# Altium schematic sheet LEDs.SchDoc
size D
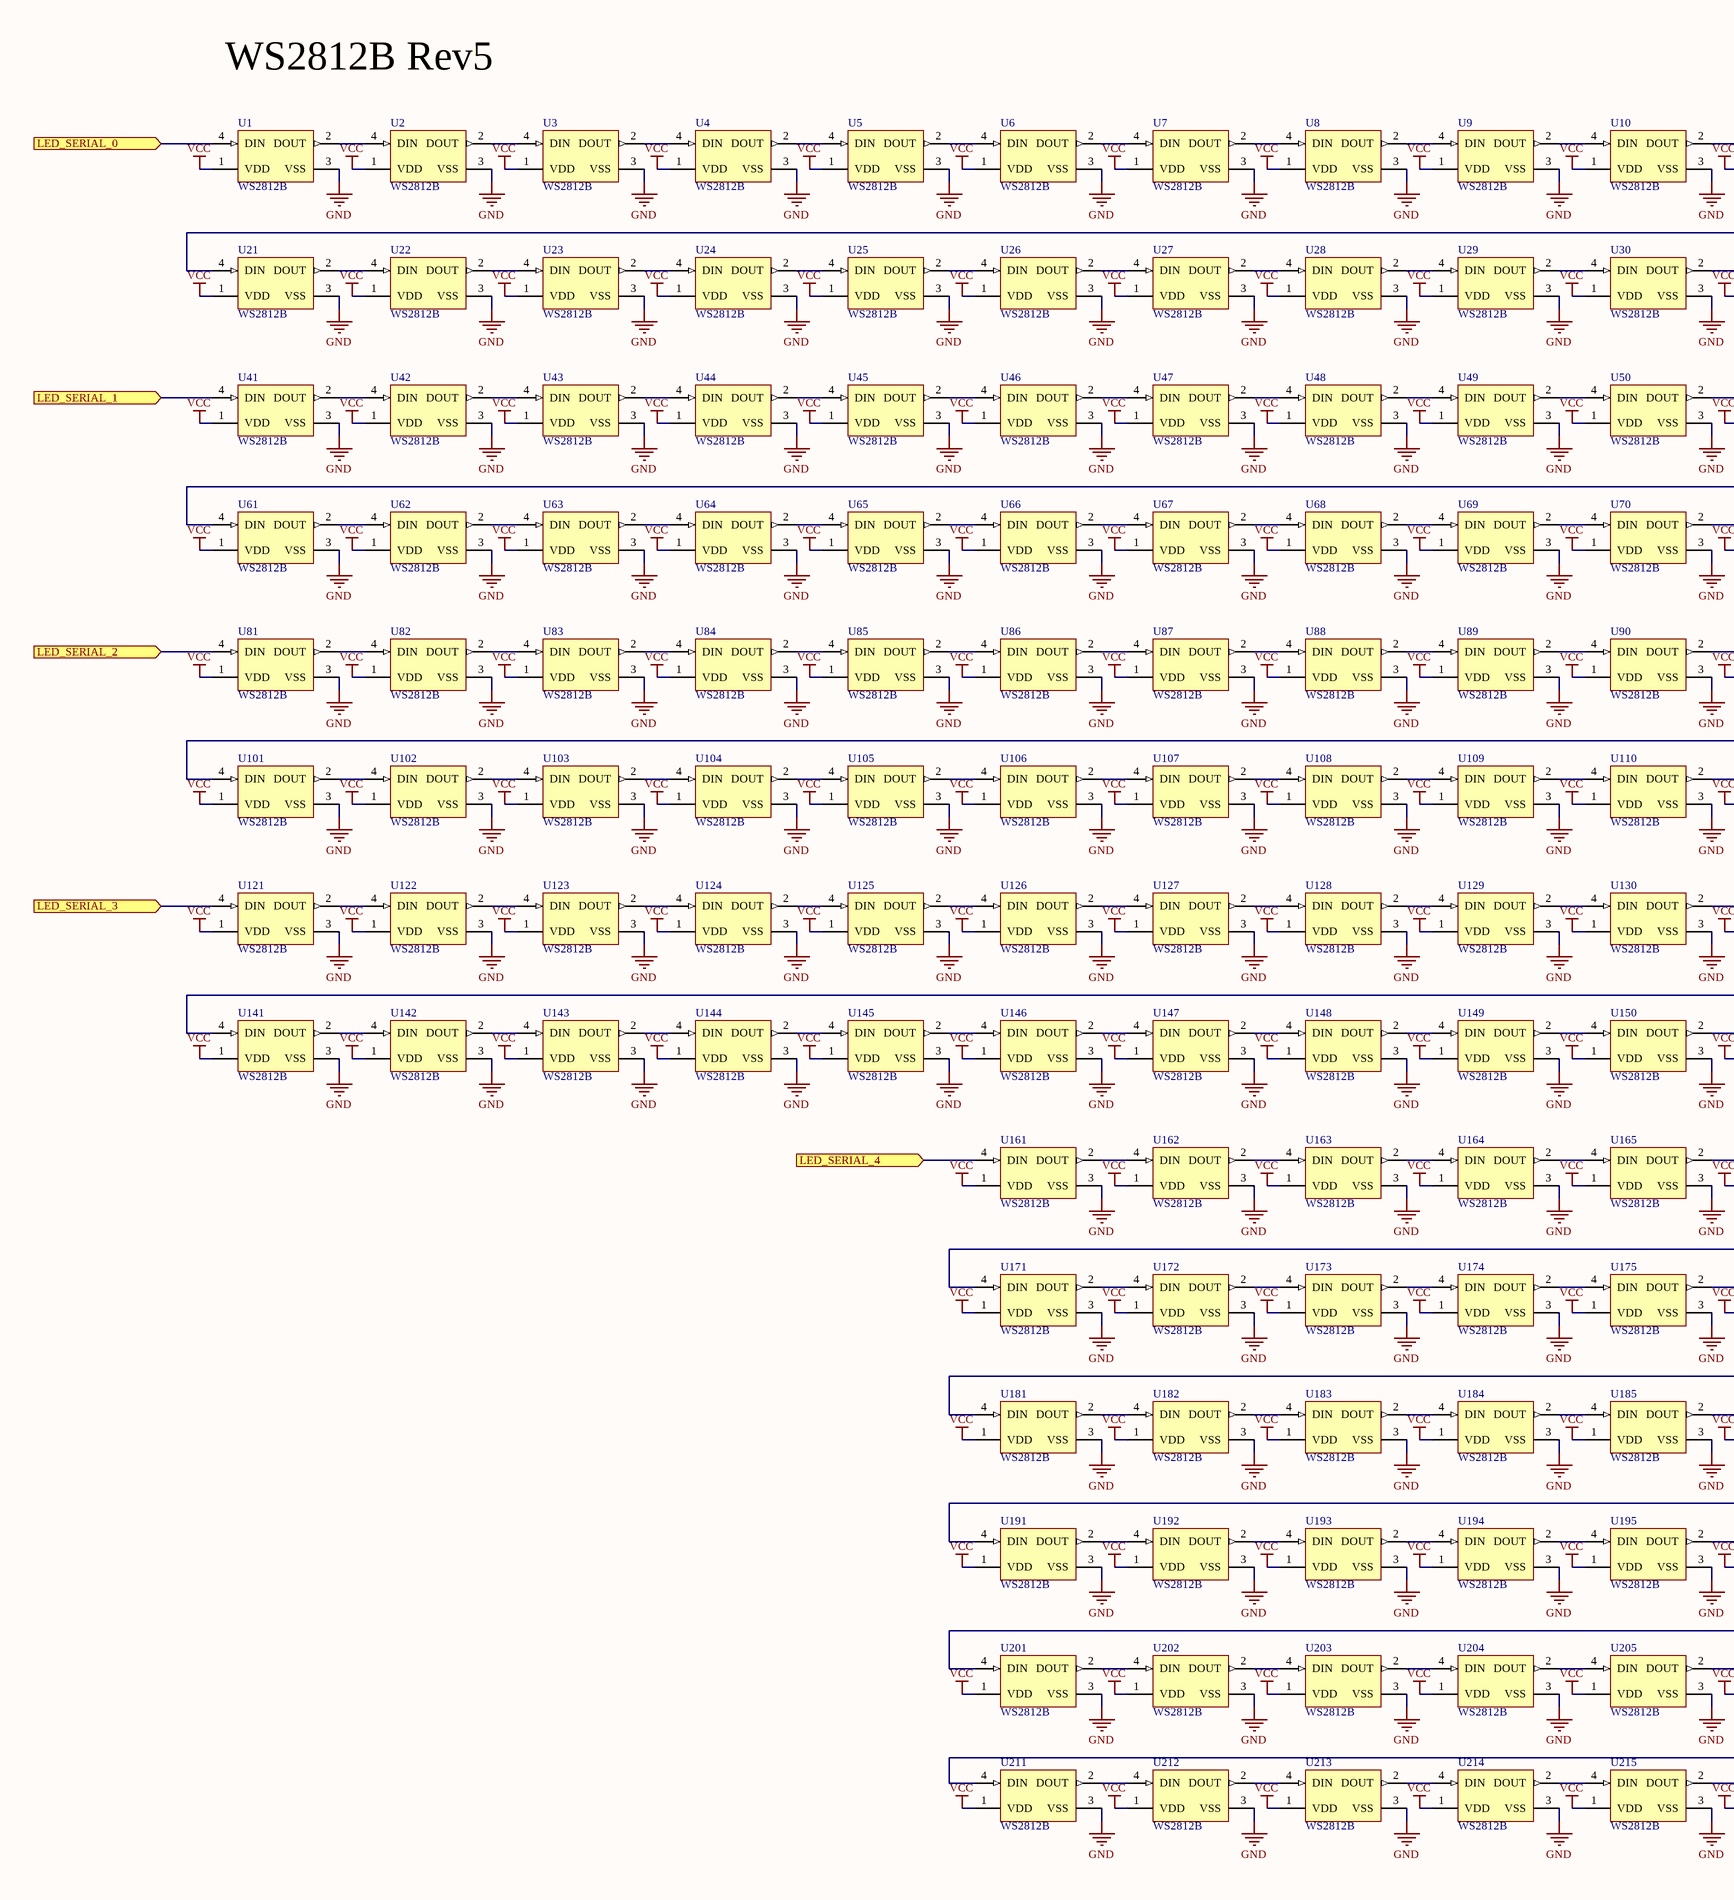
[diagram p0: LEDs.SchDoc, left]
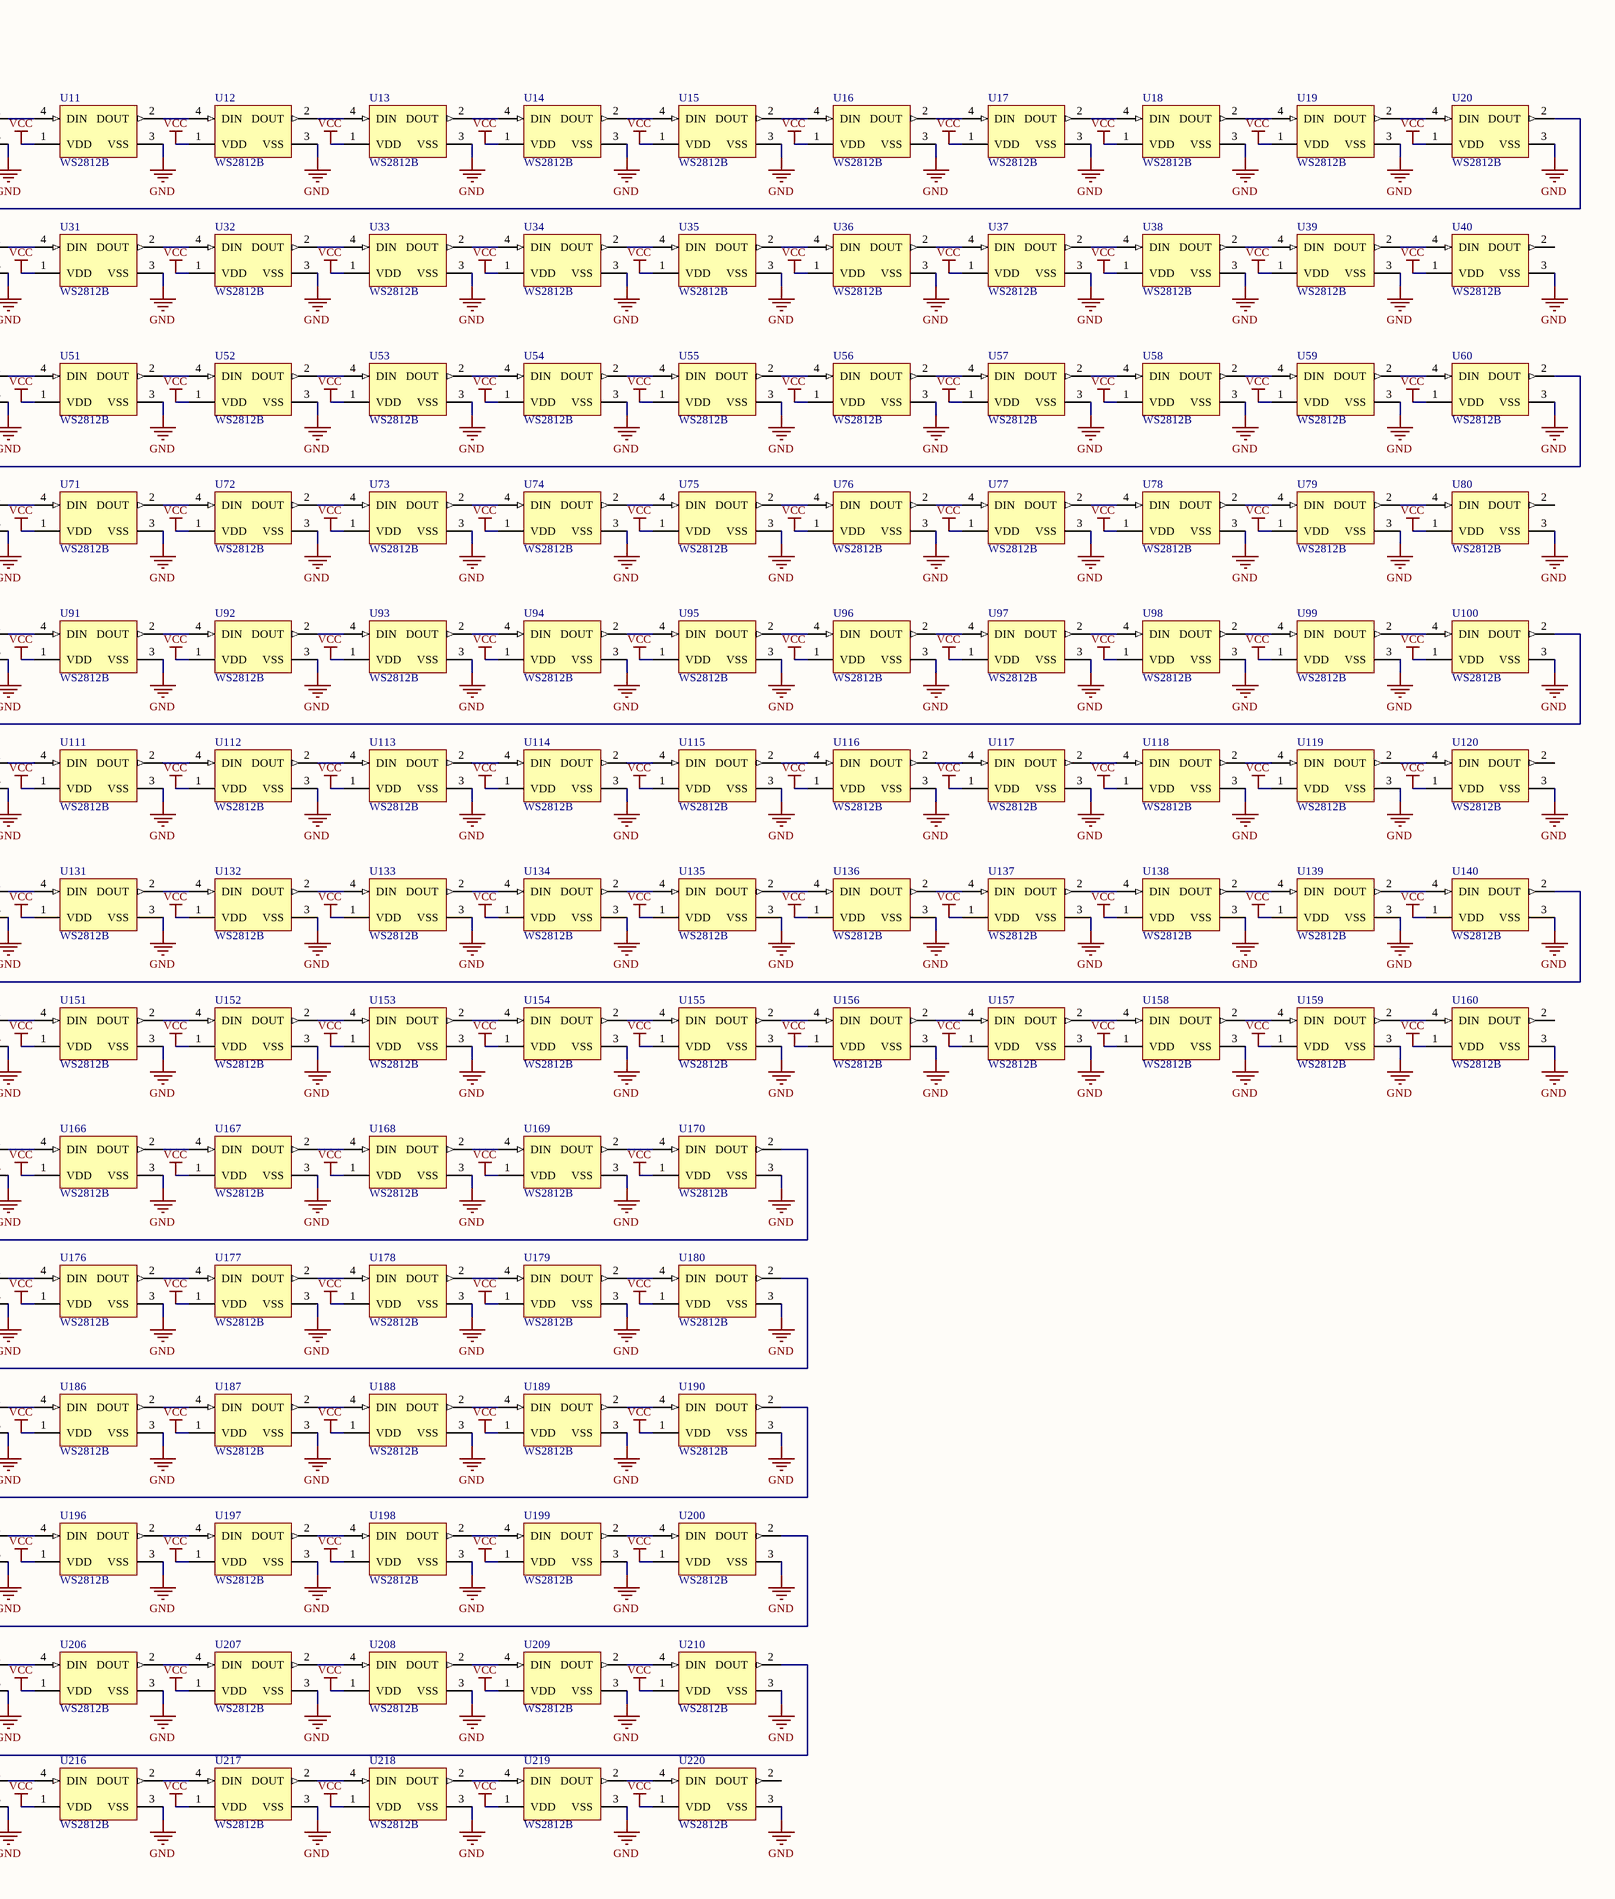
[diagram p1: LEDs.SchDoc, right]

## Parts
U1  WS2812B  [LED5050]
U2  WS2812B  [LED5050]
U3  WS2812B  [LED5050]
U4  WS2812B  [LED5050]
U5  WS2812B  [LED5050]
U6  WS2812B  [LED5050]
U7  WS2812B  [LED5050]
U8  WS2812B  [LED5050]
U9  WS2812B  [LED5050]
U10  WS2812B  [LED5050]
U11  WS2812B  [LED5050]
U12  WS2812B  [LED5050]
U13  WS2812B  [LED5050]
U14  WS2812B  [LED5050]
U15  WS2812B  [LED5050]
U16  WS2812B  [LED5050]
U17  WS2812B  [LED5050]
U18  WS2812B  [LED5050]
U19  WS2812B  [LED5050]
U20  WS2812B  [LED5050]
U21  WS2812B  [LED5050]
U22  WS2812B  [LED5050]
U23  WS2812B  [LED5050]
U24  WS2812B  [LED5050]
U25  WS2812B  [LED5050]
U26  WS2812B  [LED5050]
U27  WS2812B  [LED5050]
U28  WS2812B  [LED5050]
U29  WS2812B  [LED5050]
U30  WS2812B  [LED5050]
U31  WS2812B  [LED5050]
U32  WS2812B  [LED5050]
U33  WS2812B  [LED5050]
U34  WS2812B  [LED5050]
U35  WS2812B  [LED5050]
U36  WS2812B  [LED5050]
U37  WS2812B  [LED5050]
U38  WS2812B  [LED5050]
U39  WS2812B  [LED5050]
U40  WS2812B  [LED5050]
U41  WS2812B  [LED5050]
U42  WS2812B  [LED5050]
U43  WS2812B  [LED5050]
U44  WS2812B  [LED5050]
U45  WS2812B  [LED5050]
U46  WS2812B  [LED5050]
U47  WS2812B  [LED5050]
U48  WS2812B  [LED5050]
U49  WS2812B  [LED5050]
U50  WS2812B  [LED5050]
U51  WS2812B  [LED5050]
U52  WS2812B  [LED5050]
U53  WS2812B  [LED5050]
U54  WS2812B  [LED5050]
U55  WS2812B  [LED5050]
U56  WS2812B  [LED5050]
U57  WS2812B  [LED5050]
U58  WS2812B  [LED5050]
U59  WS2812B  [LED5050]
U60  WS2812B  [LED5050]
U61  WS2812B  [LED5050]
U62  WS2812B  [LED5050]
U63  WS2812B  [LED5050]
U64  WS2812B  [LED5050]
U65  WS2812B  [LED5050]
U66  WS2812B  [LED5050]
U67  WS2812B  [LED5050]
U68  WS2812B  [LED5050]
U69  WS2812B  [LED5050]
U70  WS2812B  [LED5050]
U71  WS2812B  [LED5050]
U72  WS2812B  [LED5050]
U73  WS2812B  [LED5050]
U74  WS2812B  [LED5050]
U75  WS2812B  [LED5050]
U76  WS2812B  [LED5050]
U77  WS2812B  [LED5050]
U78  WS2812B  [LED5050]
U79  WS2812B  [LED5050]
U80  WS2812B  [LED5050]
U81  WS2812B  [LED5050]
U82  WS2812B  [LED5050]
U83  WS2812B  [LED5050]
U84  WS2812B  [LED5050]
U85  WS2812B  [LED5050]
U86  WS2812B  [LED5050]
U87  WS2812B  [LED5050]
U88  WS2812B  [LED5050]
U89  WS2812B  [LED5050]
U90  WS2812B  [LED5050]
U91  WS2812B  [LED5050]
U92  WS2812B  [LED5050]
U93  WS2812B  [LED5050]
U94  WS2812B  [LED5050]
U95  WS2812B  [LED5050]
U96  WS2812B  [LED5050]
U97  WS2812B  [LED5050]
U98  WS2812B  [LED5050]
U99  WS2812B  [LED5050]
U100  WS2812B  [LED5050]
U101  WS2812B  [LED5050]
U102  WS2812B  [LED5050]
U103  WS2812B  [LED5050]
U104  WS2812B  [LED5050]
U105  WS2812B  [LED5050]
U106  WS2812B  [LED5050]
U107  WS2812B  [LED5050]
U108  WS2812B  [LED5050]
U109  WS2812B  [LED5050]
U110  WS2812B  [LED5050]
U111  WS2812B  [LED5050]
U112  WS2812B  [LED5050]
U113  WS2812B  [LED5050]
U114  WS2812B  [LED5050]
U115  WS2812B  [LED5050]
U116  WS2812B  [LED5050]
U117  WS2812B  [LED5050]
U118  WS2812B  [LED5050]
U119  WS2812B  [LED5050]
U120  WS2812B  [LED5050]
U121  WS2812B  [LED5050]
U122  WS2812B  [LED5050]
U123  WS2812B  [LED5050]
U124  WS2812B  [LED5050]
U125  WS2812B  [LED5050]
U126  WS2812B  [LED5050]
U127  WS2812B  [LED5050]
U128  WS2812B  [LED5050]
U129  WS2812B  [LED5050]
U130  WS2812B  [LED5050]
U131  WS2812B  [LED5050]
U132  WS2812B  [LED5050]
U133  WS2812B  [LED5050]
U134  WS2812B  [LED5050]
U135  WS2812B  [LED5050]
U136  WS2812B  [LED5050]
U137  WS2812B  [LED5050]
U138  WS2812B  [LED5050]
U139  WS2812B  [LED5050]
U140  WS2812B  [LED5050]
U141  WS2812B  [LED5050]
U142  WS2812B  [LED5050]
U143  WS2812B  [LED5050]
U144  WS2812B  [LED5050]
U145  WS2812B  [LED5050]
U146  WS2812B  [LED5050]
U147  WS2812B  [LED5050]
U148  WS2812B  [LED5050]
U149  WS2812B  [LED5050]
U150  WS2812B  [LED5050]
U151  WS2812B  [LED5050]
U152  WS2812B  [LED5050]
U153  WS2812B  [LED5050]
U154  WS2812B  [LED5050]
U155  WS2812B  [LED5050]
U156  WS2812B  [LED5050]
U157  WS2812B  [LED5050]
U158  WS2812B  [LED5050]
U159  WS2812B  [LED5050]
U160  WS2812B  [LED5050]
U161  WS2812B  [LED5050]
U162  WS2812B  [LED5050]
U163  WS2812B  [LED5050]
U164  WS2812B  [LED5050]
U165  WS2812B  [LED5050]
U166  WS2812B  [LED5050]
U167  WS2812B  [LED5050]
U168  WS2812B  [LED5050]
U169  WS2812B  [LED5050]
U170  WS2812B  [LED5050]
U171  WS2812B  [LED5050]
U172  WS2812B  [LED5050]
U173  WS2812B  [LED5050]
U174  WS2812B  [LED5050]
U175  WS2812B  [LED5050]
U176  WS2812B  [LED5050]
U177  WS2812B  [LED5050]
U178  WS2812B  [LED5050]
U179  WS2812B  [LED5050]
U180  WS2812B  [LED5050]
U181  WS2812B  [LED5050]
U182  WS2812B  [LED5050]
U183  WS2812B  [LED5050]
U184  WS2812B  [LED5050]
U185  WS2812B  [LED5050]
U186  WS2812B  [LED5050]
U187  WS2812B  [LED5050]
U188  WS2812B  [LED5050]
U189  WS2812B  [LED5050]
U190  WS2812B  [LED5050]
U191  WS2812B  [LED5050]
U192  WS2812B  [LED5050]
U193  WS2812B  [LED5050]
U194  WS2812B  [LED5050]
U195  WS2812B  [LED5050]
U196  WS2812B  [LED5050]
U197  WS2812B  [LED5050]
U198  WS2812B  [LED5050]
U199  WS2812B  [LED5050]
U200  WS2812B  [LED5050]
U201  WS2812B  [LED5050]
U202  WS2812B  [LED5050]
U203  WS2812B  [LED5050]
U204  WS2812B  [LED5050]
U205  WS2812B  [LED5050]
U206  WS2812B  [LED5050]
U207  WS2812B  [LED5050]
U208  WS2812B  [LED5050]
U209  WS2812B  [LED5050]
U210  WS2812B  [LED5050]
U211  WS2812B  [LED5050]
U212  WS2812B  [LED5050]
U213  WS2812B  [LED5050]
U214  WS2812B  [LED5050]
U215  WS2812B  [LED5050]
U216  WS2812B  [LED5050]
U217  WS2812B  [LED5050]
U218  WS2812B  [LED5050]
U219  WS2812B  [LED5050]
U220  WS2812B  [LED5050]

## Ports
LED_SERIAL_0 (in), LED_SERIAL_1 (in), LED_SERIAL_2 (in), LED_SERIAL_3 (in), LED_SERIAL_4 (in)

## Nets
GND: U1.3(VSS) U2.3(VSS) U3.3(VSS) U4.3(VSS) U5.3(VSS) U6.3(VSS) U7.3(VSS) U8.3(VSS) U9.3(VSS) U10.3(VSS) U11.3(VSS) U12.3(VSS) U13.3(VSS) U14.3(VSS) U15.3(VSS) U16.3(VSS) U17.3(VSS) U18.3(VSS) U19.3(VSS) U20.3(VSS) U21.3(VSS) U22.3(VSS) U23.3(VSS) U24.3(VSS) U25.3(VSS) U26.3(VSS) U27.3(VSS) U28.3(VSS) U29.3(VSS) U30.3(VSS) U31.3(VSS) U32.3(VSS) U33.3(VSS) U34.3(VSS) U35.3(VSS) U36.3(VSS) U37.3(VSS) U38.3(VSS) U39.3(VSS) U40.3(VSS) U41.3(VSS) U42.3(VSS) U43.3(VSS) U44.3(VSS) U45.3(VSS) U46.3(VSS) U47.3(VSS) U48.3(VSS) U49.3(VSS) U50.3(VSS) U51.3(VSS) U52.3(VSS) U53.3(VSS) U54.3(VSS) U55.3(VSS) U56.3(VSS) U57.3(VSS) U58.3(VSS) U59.3(VSS) U60.3(VSS) U61.3(VSS) U62.3(VSS) U63.3(VSS) U64.3(VSS) U65.3(VSS) U66.3(VSS) U67.3(VSS) U68.3(VSS) U69.3(VSS) U70.3(VSS) U71.3(VSS) U72.3(VSS) U73.3(VSS) U74.3(VSS) U75.3(VSS) U76.3(VSS) U77.3(VSS) U78.3(VSS) U79.3(VSS) U80.3(VSS) U81.3(VSS) U82.3(VSS) U83.3(VSS) U84.3(VSS) U85.3(VSS) U86.3(VSS) U87.3(VSS) U88.3(VSS) U89.3(VSS) U90.3(VSS) U91.3(VSS) U92.3(VSS) U93.3(VSS) U94.3(VSS) U95.3(VSS) U96.3(VSS) U97.3(VSS) U98.3(VSS) U99.3(VSS) U100.3(VSS) U101.3(VSS) U102.3(VSS) U103.3(VSS) U104.3(VSS) U105.3(VSS) U106.3(VSS) U107.3(VSS) U108.3(VSS) U109.3(VSS) U110.3(VSS) U111.3(VSS) U112.3(VSS) U113.3(VSS) U114.3(VSS) U115.3(VSS) U116.3(VSS) U117.3(VSS) U118.3(VSS) U119.3(VSS) U120.3(VSS) U121.3(VSS) U122.3(VSS) U123.3(VSS) U124.3(VSS) U125.3(VSS) U126.3(VSS) U127.3(VSS) U128.3(VSS) U129.3(VSS) U130.3(VSS) U131.3(VSS) U132.3(VSS) U133.3(VSS) U134.3(VSS) U135.3(VSS) U136.3(VSS) U137.3(VSS) U138.3(VSS) U139.3(VSS) U140.3(VSS) U141.3(VSS) U142.3(VSS) U143.3(VSS) U144.3(VSS) U145.3(VSS) U146.3(VSS) U147.3(VSS) U148.3(VSS) U149.3(VSS) U150.3(VSS) U151.3(VSS) U152.3(VSS) U153.3(VSS) U154.3(VSS) U155.3(VSS) U156.3(VSS) U157.3(VSS) U158.3(VSS) U159.3(VSS) U160.3(VSS) U161.3(VSS) U162.3(VSS) U163.3(VSS) U164.3(VSS) U165.3(VSS) U166.3(VSS) U167.3(VSS) U168.3(VSS) U169.3(VSS) U170.3(VSS) U171.3(VSS) U172.3(VSS) U173.3(VSS) U174.3(VSS) U175.3(VSS) U176.3(VSS) U177.3(VSS) U178.3(VSS) U179.3(VSS) U180.3(VSS) U181.3(VSS) U182.3(VSS) U183.3(VSS) U184.3(VSS) U185.3(VSS) U186.3(VSS) U187.3(VSS) U188.3(VSS) U189.3(VSS) U190.3(VSS) U191.3(VSS) U192.3(VSS) U193.3(VSS) U194.3(VSS) U195.3(VSS) U196.3(VSS) U197.3(VSS) U198.3(VSS) U199.3(VSS) U200.3(VSS) U201.3(VSS) U202.3(VSS) U203.3(VSS) U204.3(VSS) U205.3(VSS) U206.3(VSS) U207.3(VSS) U208.3(VSS) U209.3(VSS) U210.3(VSS) U211.3(VSS) U212.3(VSS) U213.3(VSS) U214.3(VSS) U215.3(VSS) U216.3(VSS) U217.3(VSS) U218.3(VSS) U219.3(VSS) U220.3(VSS)
VCC: U1.1(VDD) U2.1(VDD) U3.1(VDD) U4.1(VDD) U5.1(VDD) U6.1(VDD) U7.1(VDD) U8.1(VDD) U9.1(VDD) U10.1(VDD) U11.1(VDD) U12.1(VDD) U13.1(VDD) U14.1(VDD) U15.1(VDD) U16.1(VDD) U17.1(VDD) U18.1(VDD) U19.1(VDD) U20.1(VDD) U21.1(VDD) U22.1(VDD) U23.1(VDD) U24.1(VDD) U25.1(VDD) U26.1(VDD) U27.1(VDD) U28.1(VDD) U29.1(VDD) U30.1(VDD) U31.1(VDD) U32.1(VDD) U33.1(VDD) U34.1(VDD) U35.1(VDD) U36.1(VDD) U37.1(VDD) U38.1(VDD) U39.1(VDD) U40.1(VDD) U41.1(VDD) U42.1(VDD) U43.1(VDD) U44.1(VDD) U45.1(VDD) U46.1(VDD) U47.1(VDD) U48.1(VDD) U49.1(VDD) U50.1(VDD) U51.1(VDD) U52.1(VDD) U53.1(VDD) U54.1(VDD) U55.1(VDD) U56.1(VDD) U57.1(VDD) U58.1(VDD) U59.1(VDD) U60.1(VDD) U61.1(VDD) U62.1(VDD) U63.1(VDD) U64.1(VDD) U65.1(VDD) U66.1(VDD) U67.1(VDD) U68.1(VDD) U69.1(VDD) U70.1(VDD) U71.1(VDD) U72.1(VDD) U73.1(VDD) U74.1(VDD) U75.1(VDD) U76.1(VDD) U77.1(VDD) U78.1(VDD) U79.1(VDD) U80.1(VDD) U81.1(VDD) U82.1(VDD) U83.1(VDD) U84.1(VDD) U85.1(VDD) U86.1(VDD) U87.1(VDD) U88.1(VDD) U89.1(VDD) U90.1(VDD) U91.1(VDD) U92.1(VDD) U93.1(VDD) U94.1(VDD) U95.1(VDD) U96.1(VDD) U97.1(VDD) U98.1(VDD) U99.1(VDD) U100.1(VDD) U101.1(VDD) U102.1(VDD) U103.1(VDD) U104.1(VDD) U105.1(VDD) U106.1(VDD) U107.1(VDD) U108.1(VDD) U109.1(VDD) U110.1(VDD) U111.1(VDD) U112.1(VDD) U113.1(VDD) U114.1(VDD) U115.1(VDD) U116.1(VDD) U117.1(VDD) U118.1(VDD) U119.1(VDD) U120.1(VDD) U121.1(VDD) U122.1(VDD) U123.1(VDD) U124.1(VDD) U125.1(VDD) U126.1(VDD) U127.1(VDD) U128.1(VDD) U129.1(VDD) U130.1(VDD) U131.1(VDD) U132.1(VDD) U133.1(VDD) U134.1(VDD) U135.1(VDD) U136.1(VDD) U137.1(VDD) U138.1(VDD) U139.1(VDD) U140.1(VDD) U141.1(VDD) U142.1(VDD) U143.1(VDD) U144.1(VDD) U145.1(VDD) U146.1(VDD) U147.1(VDD) U148.1(VDD) U149.1(VDD) U150.1(VDD) U151.1(VDD) U152.1(VDD) U153.1(VDD) U154.1(VDD) U155.1(VDD) U156.1(VDD) U157.1(VDD) U158.1(VDD) U159.1(VDD) U160.1(VDD) U161.1(VDD) U162.1(VDD) U163.1(VDD) U164.1(VDD) U165.1(VDD) U166.1(VDD) U167.1(VDD) U168.1(VDD) U169.1(VDD) U170.1(VDD) U171.1(VDD) U172.1(VDD) U173.1(VDD) U174.1(VDD) U175.1(VDD) U176.1(VDD) U177.1(VDD) U178.1(VDD) U179.1(VDD) U180.1(VDD) U181.1(VDD) U182.1(VDD) U183.1(VDD) U184.1(VDD) U185.1(VDD) U186.1(VDD) U187.1(VDD) U188.1(VDD) U189.1(VDD) U190.1(VDD) U191.1(VDD) U192.1(VDD) U193.1(VDD) U194.1(VDD) U195.1(VDD) U196.1(VDD) U197.1(VDD) U198.1(VDD) U199.1(VDD) U200.1(VDD) U201.1(VDD) U202.1(VDD) U203.1(VDD) U204.1(VDD) U205.1(VDD) U206.1(VDD) U207.1(VDD) U208.1(VDD) U209.1(VDD) U210.1(VDD) U211.1(VDD) U212.1(VDD) U213.1(VDD) U214.1(VDD) U215.1(VDD) U216.1(VDD) U217.1(VDD) U218.1(VDD) U219.1(VDD) U220.1(VDD)
LED_SERIAL_0: U1.4(DIN) ; port LED_SERIAL_0
LED_SERIAL_1: U41.4(DIN) ; port LED_SERIAL_1
LED_SERIAL_2: U81.4(DIN) ; port LED_SERIAL_2
LED_SERIAL_3: U121.4(DIN) ; port LED_SERIAL_3
LED_SERIAL_4: U161.4(DIN) ; port LED_SERIAL_4
NetU1_2: U1.2(DOUT) U2.4(DIN)
NetU2_2: U2.2(DOUT) U3.4(DIN)
NetU3_2: U3.2(DOUT) U4.4(DIN)
NetU4_2: U4.2(DOUT) U5.4(DIN)
NetU5_2: U5.2(DOUT) U6.4(DIN)
NetU6_2: U6.2(DOUT) U7.4(DIN)
NetU7_2: U7.2(DOUT) U8.4(DIN)
NetU8_2: U8.2(DOUT) U9.4(DIN)
NetU9_2: U9.2(DOUT) U10.4(DIN)
NetU10_2: U10.2(DOUT) U11.4(DIN)
NetU11_2: U11.2(DOUT) U12.4(DIN)
NetU12_2: U12.2(DOUT) U13.4(DIN)
NetU13_2: U13.2(DOUT) U14.4(DIN)
NetU14_2: U14.2(DOUT) U15.4(DIN)
NetU15_2: U15.2(DOUT) U16.4(DIN)
NetU16_2: U16.2(DOUT) U17.4(DIN)
NetU17_2: U17.2(DOUT) U18.4(DIN)
NetU18_2: U18.2(DOUT) U19.4(DIN)
NetU19_2: U19.2(DOUT) U20.4(DIN)
NetU20_2: U20.2(DOUT) U21.4(DIN)
NetU21_2: U21.2(DOUT) U22.4(DIN)
NetU22_2: U22.2(DOUT) U23.4(DIN)
NetU23_2: U23.2(DOUT) U24.4(DIN)
NetU24_2: U24.2(DOUT) U25.4(DIN)
NetU25_2: U25.2(DOUT) U26.4(DIN)
NetU26_2: U26.2(DOUT) U27.4(DIN)
NetU27_2: U27.2(DOUT) U28.4(DIN)
NetU28_2: U28.2(DOUT) U29.4(DIN)
NetU29_2: U29.2(DOUT) U30.4(DIN)
NetU30_2: U30.2(DOUT) U31.4(DIN)
NetU31_2: U31.2(DOUT) U32.4(DIN)
NetU32_2: U32.2(DOUT) U33.4(DIN)
NetU33_2: U33.2(DOUT) U34.4(DIN)
NetU34_2: U34.2(DOUT) U35.4(DIN)
NetU35_2: U35.2(DOUT) U36.4(DIN)
NetU36_2: U36.2(DOUT) U37.4(DIN)
NetU37_2: U37.2(DOUT) U38.4(DIN)
NetU38_2: U38.2(DOUT) U39.4(DIN)
NetU39_2: U39.2(DOUT) U40.4(DIN)
NetU41_2: U41.2(DOUT) U42.4(DIN)
NetU42_2: U42.2(DOUT) U43.4(DIN)
NetU43_2: U43.2(DOUT) U44.4(DIN)
NetU44_2: U44.2(DOUT) U45.4(DIN)
NetU45_2: U45.2(DOUT) U46.4(DIN)
NetU46_2: U46.2(DOUT) U47.4(DIN)
NetU47_2: U47.2(DOUT) U48.4(DIN)
NetU48_2: U48.2(DOUT) U49.4(DIN)
NetU49_2: U49.2(DOUT) U50.4(DIN)
NetU50_2: U50.2(DOUT) U51.4(DIN)
NetU51_2: U51.2(DOUT) U52.4(DIN)
NetU52_2: U52.2(DOUT) U53.4(DIN)
NetU53_2: U53.2(DOUT) U54.4(DIN)
NetU54_2: U54.2(DOUT) U55.4(DIN)
NetU55_2: U55.2(DOUT) U56.4(DIN)
NetU56_2: U56.2(DOUT) U57.4(DIN)
NetU57_2: U57.2(DOUT) U58.4(DIN)
NetU58_2: U58.2(DOUT) U59.4(DIN)
NetU59_2: U59.2(DOUT) U60.4(DIN)
NetU60_2: U60.2(DOUT) U61.4(DIN)
NetU61_2: U61.2(DOUT) U62.4(DIN)
NetU62_2: U62.2(DOUT) U63.4(DIN)
NetU63_2: U63.2(DOUT) U64.4(DIN)
NetU64_2: U64.2(DOUT) U65.4(DIN)
NetU65_2: U65.2(DOUT) U66.4(DIN)
NetU66_2: U66.2(DOUT) U67.4(DIN)
NetU67_2: U67.2(DOUT) U68.4(DIN)
NetU68_2: U68.2(DOUT) U69.4(DIN)
NetU69_2: U69.2(DOUT) U70.4(DIN)
NetU70_2: U70.2(DOUT) U71.4(DIN)
NetU71_2: U71.2(DOUT) U72.4(DIN)
NetU72_2: U72.2(DOUT) U73.4(DIN)
NetU73_2: U73.2(DOUT) U74.4(DIN)
NetU74_2: U74.2(DOUT) U75.4(DIN)
NetU75_2: U75.2(DOUT) U76.4(DIN)
NetU76_2: U76.2(DOUT) U77.4(DIN)
NetU77_2: U77.2(DOUT) U78.4(DIN)
NetU78_2: U78.2(DOUT) U79.4(DIN)
NetU79_2: U79.2(DOUT) U80.4(DIN)
NetU81_2: U81.2(DOUT) U82.4(DIN)
NetU82_2: U82.2(DOUT) U83.4(DIN)
NetU83_2: U83.2(DOUT) U84.4(DIN)
NetU84_2: U84.2(DOUT) U85.4(DIN)
NetU85_2: U85.2(DOUT) U86.4(DIN)
NetU86_2: U86.2(DOUT) U87.4(DIN)
NetU87_2: U87.2(DOUT) U88.4(DIN)
NetU88_2: U88.2(DOUT) U89.4(DIN)
NetU89_2: U89.2(DOUT) U90.4(DIN)
NetU90_2: U90.2(DOUT) U91.4(DIN)
NetU91_2: U91.2(DOUT) U92.4(DIN)
NetU92_2: U92.2(DOUT) U93.4(DIN)
NetU93_2: U93.2(DOUT) U94.4(DIN)
NetU94_2: U94.2(DOUT) U95.4(DIN)
NetU95_2: U95.2(DOUT) U96.4(DIN)
NetU96_2: U96.2(DOUT) U97.4(DIN)
NetU97_2: U97.2(DOUT) U98.4(DIN)
NetU98_2: U98.2(DOUT) U99.4(DIN)
NetU99_2: U99.2(DOUT) U100.4(DIN)
NetU100_2: U100.2(DOUT) U101.4(DIN)
NetU101_2: U101.2(DOUT) U102.4(DIN)
NetU102_2: U102.2(DOUT) U103.4(DIN)
NetU103_2: U103.2(DOUT) U104.4(DIN)
NetU104_2: U104.2(DOUT) U105.4(DIN)
NetU105_2: U105.2(DOUT) U106.4(DIN)
NetU106_2: U106.2(DOUT) U107.4(DIN)
NetU107_2: U107.2(DOUT) U108.4(DIN)
NetU108_2: U108.2(DOUT) U109.4(DIN)
NetU109_2: U109.2(DOUT) U110.4(DIN)
NetU110_2: U110.2(DOUT) U111.4(DIN)
NetU111_2: U111.2(DOUT) U112.4(DIN)
NetU112_2: U112.2(DOUT) U113.4(DIN)
NetU113_2: U113.2(DOUT) U114.4(DIN)
NetU114_2: U114.2(DOUT) U115.4(DIN)
NetU115_2: U115.2(DOUT) U116.4(DIN)
NetU116_2: U116.2(DOUT) U117.4(DIN)
NetU117_2: U117.2(DOUT) U118.4(DIN)
NetU118_2: U118.2(DOUT) U119.4(DIN)
NetU119_2: U119.2(DOUT) U120.4(DIN)
NetU121_2: U121.2(DOUT) U122.4(DIN)
NetU122_2: U122.2(DOUT) U123.4(DIN)
NetU123_2: U123.2(DOUT) U124.4(DIN)
NetU124_2: U124.2(DOUT) U125.4(DIN)
NetU125_2: U125.2(DOUT) U126.4(DIN)
NetU126_2: U126.2(DOUT) U127.4(DIN)
NetU127_2: U127.2(DOUT) U128.4(DIN)
NetU128_2: U128.2(DOUT) U129.4(DIN)
NetU129_2: U129.2(DOUT) U130.4(DIN)
NetU130_2: U130.2(DOUT) U131.4(DIN)
NetU131_2: U131.2(DOUT) U132.4(DIN)
NetU132_2: U132.2(DOUT) U133.4(DIN)
NetU133_2: U133.2(DOUT) U134.4(DIN)
NetU134_2: U134.2(DOUT) U135.4(DIN)
NetU135_2: U135.2(DOUT) U136.4(DIN)
NetU136_2: U136.2(DOUT) U137.4(DIN)
NetU137_2: U137.2(DOUT) U138.4(DIN)
NetU138_2: U138.2(DOUT) U139.4(DIN)
NetU139_2: U139.2(DOUT) U140.4(DIN)
NetU140_2: U140.2(DOUT) U141.4(DIN)
NetU141_2: U141.2(DOUT) U142.4(DIN)
NetU142_2: U142.2(DOUT) U143.4(DIN)
NetU143_2: U143.2(DOUT) U144.4(DIN)
NetU144_2: U144.2(DOUT) U145.4(DIN)
NetU145_2: U145.2(DOUT) U146.4(DIN)
NetU146_2: U146.2(DOUT) U147.4(DIN)
NetU147_2: U147.2(DOUT) U148.4(DIN)
NetU148_2: U148.2(DOUT) U149.4(DIN)
NetU149_2: U149.2(DOUT) U150.4(DIN)
NetU150_2: U150.2(DOUT) U151.4(DIN)
NetU151_2: U151.2(DOUT) U152.4(DIN)
NetU152_2: U152.2(DOUT) U153.4(DIN)
NetU153_2: U153.2(DOUT) U154.4(DIN)
NetU154_2: U154.2(DOUT) U155.4(DIN)
NetU155_2: U155.2(DOUT) U156.4(DIN)
NetU156_2: U156.2(DOUT) U157.4(DIN)
NetU157_2: U157.2(DOUT) U158.4(DIN)
NetU158_2: U158.2(DOUT) U159.4(DIN)
NetU159_2: U159.2(DOUT) U160.4(DIN)
NetU161_2: U161.2(DOUT) U162.4(DIN)
NetU162_2: U162.2(DOUT) U163.4(DIN)
NetU163_2: U163.2(DOUT) U164.4(DIN)
NetU164_2: U164.2(DOUT) U165.4(DIN)
NetU165_2: U165.2(DOUT) U166.4(DIN)
NetU166_2: U166.2(DOUT) U167.4(DIN)
NetU167_2: U167.2(DOUT) U168.4(DIN)
NetU168_2: U168.2(DOUT) U169.4(DIN)
NetU169_2: U169.2(DOUT) U170.4(DIN)
NetU170_2: U170.2(DOUT) U171.4(DIN)
NetU171_2: U171.2(DOUT) U172.4(DIN)
NetU172_2: U172.2(DOUT) U173.4(DIN)
NetU173_2: U173.2(DOUT) U174.4(DIN)
NetU174_2: U174.2(DOUT) U175.4(DIN)
NetU175_2: U175.2(DOUT) U176.4(DIN)
NetU176_2: U176.2(DOUT) U177.4(DIN)
NetU177_2: U177.2(DOUT) U178.4(DIN)
NetU178_2: U178.2(DOUT) U179.4(DIN)
NetU179_2: U179.2(DOUT) U180.4(DIN)
NetU180_2: U180.2(DOUT) U181.4(DIN)
NetU181_2: U181.2(DOUT) U182.4(DIN)
NetU182_2: U182.2(DOUT) U183.4(DIN)
NetU183_2: U183.2(DOUT) U184.4(DIN)
NetU184_2: U184.2(DOUT) U185.4(DIN)
NetU185_2: U185.2(DOUT) U186.4(DIN)
NetU186_2: U186.2(DOUT) U187.4(DIN)
NetU187_2: U187.2(DOUT) U188.4(DIN)
NetU188_2: U188.2(DOUT) U189.4(DIN)
NetU189_2: U189.2(DOUT) U190.4(DIN)
NetU190_2: U190.2(DOUT) U191.4(DIN)
NetU191_2: U191.2(DOUT) U192.4(DIN)
NetU192_2: U192.2(DOUT) U193.4(DIN)
NetU193_2: U193.2(DOUT) U194.4(DIN)
NetU194_2: U194.2(DOUT) U195.4(DIN)
NetU195_2: U195.2(DOUT) U196.4(DIN)
NetU196_2: U196.2(DOUT) U197.4(DIN)
NetU197_2: U197.2(DOUT) U198.4(DIN)
NetU198_2: U198.2(DOUT) U199.4(DIN)
NetU199_2: U199.2(DOUT) U200.4(DIN)
NetU200_2: U200.2(DOUT) U201.4(DIN)
NetU201_2: U201.2(DOUT) U202.4(DIN)
NetU202_2: U202.2(DOUT) U203.4(DIN)
NetU203_2: U203.2(DOUT) U204.4(DIN)
NetU204_2: U204.2(DOUT) U205.4(DIN)
NetU205_2: U205.2(DOUT) U206.4(DIN)
NetU206_2: U206.2(DOUT) U207.4(DIN)
NetU207_2: U207.2(DOUT) U208.4(DIN)
NetU208_2: U208.2(DOUT) U209.4(DIN)
NetU209_2: U209.2(DOUT) U210.4(DIN)
NetU210_2: U210.2(DOUT) U211.4(DIN)
NetU211_2: U211.2(DOUT) U212.4(DIN)
NetU212_2: U212.2(DOUT) U213.4(DIN)
NetU213_2: U213.2(DOUT) U214.4(DIN)
NetU214_2: U214.2(DOUT) U215.4(DIN)
NetU215_2: U215.2(DOUT) U216.4(DIN)
NetU216_2: U216.2(DOUT) U217.4(DIN)
NetU217_2: U217.2(DOUT) U218.4(DIN)
NetU218_2: U218.2(DOUT) U219.4(DIN)
NetU219_2: U219.2(DOUT) U220.4(DIN)

Not connected (* = marked no-connect by the designer): U40 2(DOUT); U80 2(DOUT); U120 2(DOUT); U160 2(DOUT); U220 2(DOUT)

## Notes on the sheet
- WS2812B Rev5

## Library data of the parts
U1-U220 = CMP-2000-05026-1: Intelligent Control LED Integrated Light Source, 3.5 to 5.3 V, -25 to 80 degC, 4-Pin SMD, RoHS, Tape and Reel; Manufacturer: Adafruit-Industries-LLC; Number of LEDs: 10; Configuration: Discrete; Utilized LED: WS2812(5050); Datasheet URL: http://datasheet.octopart.com/ADA1655-Adafruit-Industries-datasheet-32028139.pdf; Series: Neopixel; Interface: -; Package Description: 4-Pin Surface Mount Device, Body 5 x 5 mm; Color: Red,Green,Blue(RGB); Category: Optoelectronics; Controller Type: -; Package Reference: 1655; Manufacturer URL: https://www.adafruit.com/; Mounting Type: SurfaceMount; Datasheet Version: May-13; Size / Dimension: 5.00mmLx5.00mmW; Family: Addressable,Specialty; LCSC Part #: C114586